# EAGLE design cc2538-solo (EAGLE 7.0.0)
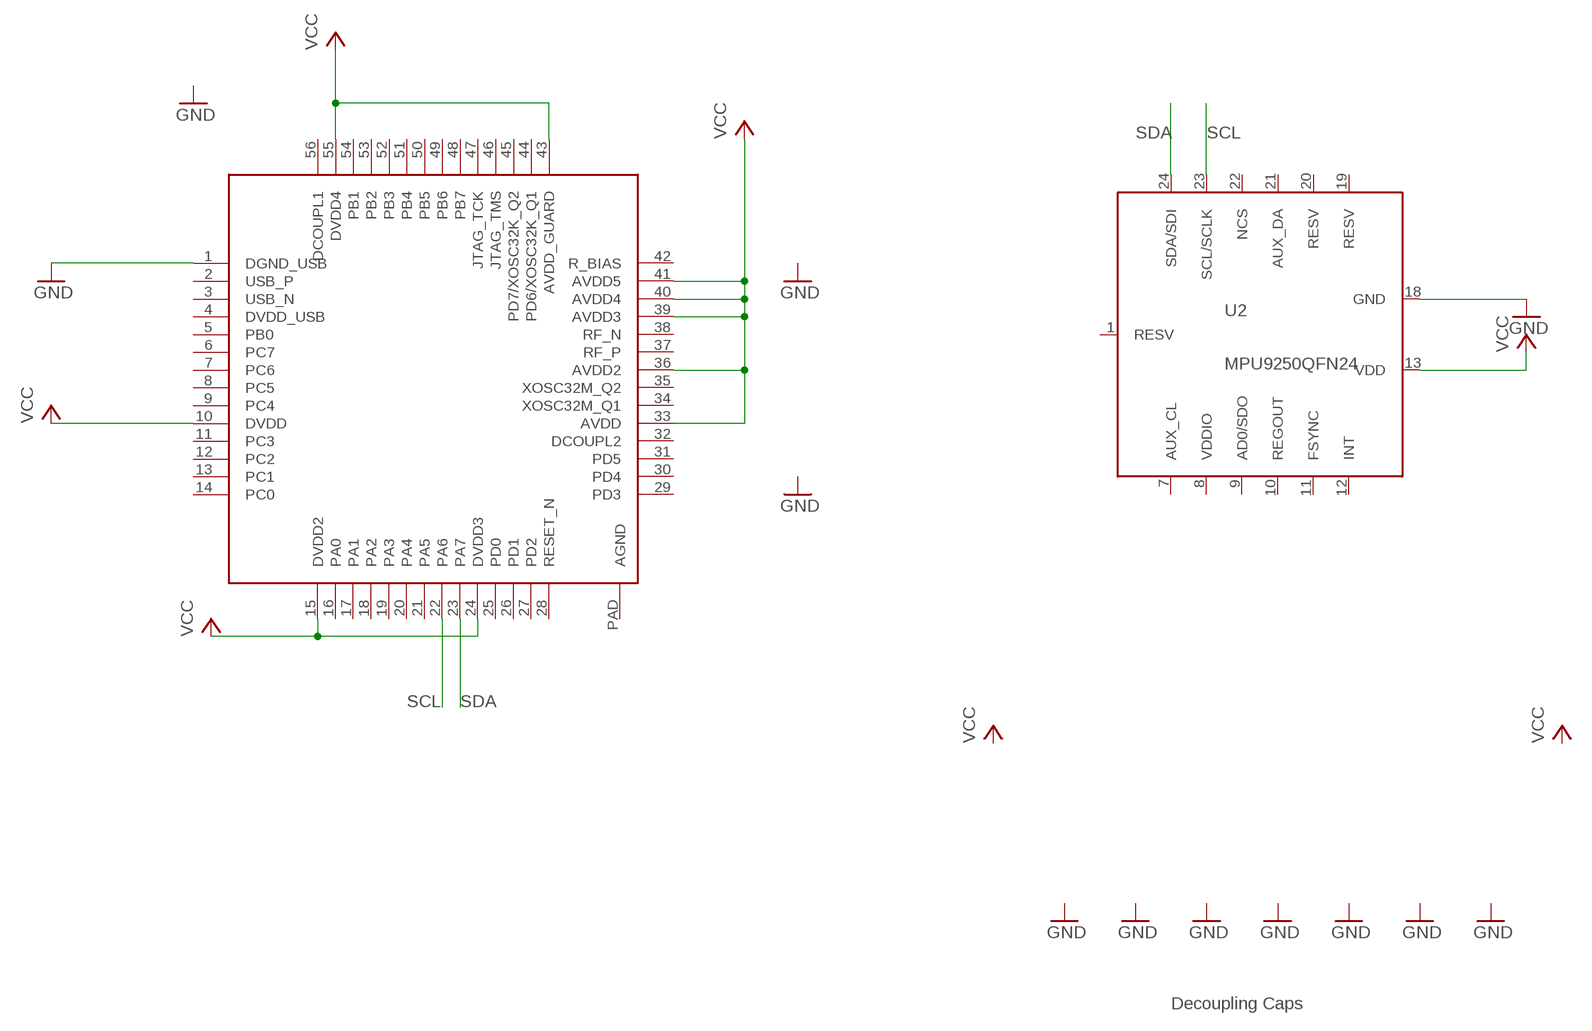
[diagram p0: schematic, sheet 1]

## Parts
U1  CC2538  [QFN56]
U2  MPU9250QFN24  [QFN]

## Nets
GND: U1.1(DGND_USB) U2.18(GND)
SCL: U1.22(PA6) U2.23(SCL/SCLK)
SDA: U1.23(PA7) U2.24(SDA/SDI)
VCC: U1.10(DVDD) U1.15(DVDD2) U1.24(DVDD3) U1.33(AVDD) U1.36(AVDD2) U1.39(AVDD3) U1.40(AVDD4) U1.41(AVDD5) U1.43(AVDD_GUARD) U1.55(DVDD4) U2.13(VDD)
Unconnected: U1.2(USB_P) U1.3(USB_N) U1.4(DVDD_USB) U1.5(PB0) U1.6(PC7) U1.7(PC6) U1.8(PC5) U1.9(PC4) U1.11(PC3) U1.12(PC2) U1.13(PC1) U1.14(PC0) U1.16(PA0) U1.17(PA1) U1.18(PA2) U1.19(PA3) U1.20(PA4) U1.21(PA5) U1.25(PD0) U1.26(PD1) U1.27(PD2) U1.28(RESET_N) U1.29(PD3) U1.30(PD4) U1.31(PD5) U1.32(DCOUPL2) U1.34(XOSC32M_Q1) U1.35(XOSC32M_Q2) U1.37(RF_P) U1.38(RF_N) U1.42(R_BIAS) U1.44(PD6/XOSC32K_Q1) U1.45(PD7/XOSC32K_Q2) U1.46(JTAG_TMS) U1.47(JTAG_TCK) U1.48(PB7) U1.49(PB6) U1.50(PB5) U1.51(PB4) U1.52(PB3) U1.53(PB2) U1.54(PB1) U1.56(DCOUPL1) U1.PAD(AGND) U2.1(RESV) U2.7(AUX_CL) U2.9(AD0/SDO) U2.10(REGOUT) U2.11(FSYNC) U2.12(INT) U2.19(RESV) U2.20(RESV) U2.21(AUX_DA) U2.22(NCS)

## Notes on the sheet
- Decoupling Caps

## Power pins joined to a net without a drawn wire
VDDIO: U2.8(VDDIO)

## Library data of the parts
U1 = ic:CC2538
U2 = NuGina_Parts:MPU9250: MPU9250, the new hotness in Invensys IMUs.

## Net classes
0 default: width 0.152 mm, drill 0.305 mm, clearance 0.152 mm
1 RF: width 0.152 mm, clearance 0.152 mm

## Board
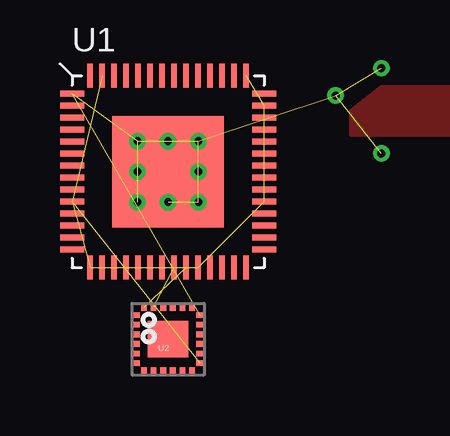
[diagram p1: board, top side]

No outline drawn. Coordinates in mm, seen from the top.
Copper layers (1*16): Top 0.0356mm / dielectric 1.5011mm / Bottom 0.0356mm
Design rules "LaenPCBOrder": minimum track width 6mil, minimum drill 13mil, track to track 6mil, track to pad 6mil, pad to pad 6mil, via to via 6mil, smd to smd 6mil, copper to edge 15mil, drill to drill 6mil, minimum pad ring 7mil, minimum via ring 7mil, stop-mask expansion 4mil, vias tented up to drill 0mil, thermal gap 10mil

### Footprints (pad centres in the part's own frame; a part is rotated, then mirrored left to right if it is on the bottom)
QFN56 = smd 1 x 0.24: 1 -4,3.25; 2 -4,2.75; 3 -4,2.25; 4 -4,1.75; 5 -4,1.25; 6 -4,0.75; 7 -4,0.25; 8 -4,-0.25; 9 -4,-0.75; 10 -4,-1.25; 11 -4,-1.75; 12 -4,-2.25; 13 -4,-2.75; 14 -4,-3.25; 29 4,-3.25; 30 4,-2.75; 31 4,-2.25; 32 4,-1.75; 33 4,-1.25; 34 4,-0.75; 35 4,-0.25; 36 4,0.25; 37 4,0.75; 38 4,1.25; 39 4,1.75; 40 4,2.25; 41 4,2.75; 42 4,3.25 | smd 0.24 x 1: 15 -3.25,-4; 16 -2.75,-4; 17 -2.25,-4; 18 -1.75,-4; 19 -1.25,-4; 20 -0.75,-4; 21 -0.25,-4; 22 0.25,-4; 23 0.75,-4; 24 1.25,-4; 25 1.75,-4; 26 2.25,-4; 27 2.75,-4; 28 3.25,-4; 43 3.25,4; 44 2.75,4; 45 2.25,4; 46 1.75,4; 47 1.25,4; 48 0.75,4; 49 0.25,4; 50 -0.25,4; 51 -0.75,4; 52 -1.25,4; 53 -1.75,4; 54 -2.25,4; 55 -2.75,4; 56 -3.25,4 | smd 4.65 x 4.65: PAD 0,0
QFN = smd 0.36 x 0.24: 1 -1.35,1; 2 -1.35,0.6; 3 -1.35,0.2; 4 -1.35,-0.2; 5 -1.35,-0.6; 6 -1.35,-1; 13 1.35,-1; 14 1.35,-0.6; 15 1.35,-0.2; 16 1.35,0.2; 17 1.35,0.6; 18 1.35,1 | smd 0.24 x 0.36: 7 -1,-1.35; 8 -0.6,-1.35; 9 -0.2,-1.35; 10 0.2,-1.35; 11 0.6,-1.35; 12 1,-1.35; 19 1,1.35; 20 0.6,1.35; 21 0.2,1.35; 22 -0.2,1.35; 23 -0.6,1.35; 24 -1,1.35 | smd 1.7 x 1.54: C 0,0

### Placement (x,y rotation side)
U1  32.38,13.97 0 top
U2  32.38,6.99 0 top

### Tracks (layer width: path | path; a pad name or v marks a point on that pad's centre or on a via)
GND  (via drill 0.33 pad 0.69)  (12 unrouted)
  other vias: 31.11,13.97 31.11,15.24 32.38,15.24 33.66,15.24 33.66,13.97 33.66,12.7 32.38,12.7 31.11,12.7 39.37,17.14 41.27,14.73 41.27,18.29
RF
  pour Top (no thermals): 45.21,17.53 45.21,15.49 40.01,15.49 40.01,16.51 41.27,17.53
SCL  (1 unrouted)
SDA  (1 unrouted)
VCC  (10 unrouted)

### Text on the board
bNames: (c) 2013, Damjan Marion | cc2538-dev-v1